# EasyEDA Pro project ProPrj_ESP32-S3-DevKitC-1-V1.2(立创EDA专业版导入可直接打样).epro

# Schematic ESP32-S3
Create Date: 2023-03-21; Page Name: P1; Project Name: ESP32-S3-DevKitC-1-V1.2; Schematic Name: ESP32-S3; Update Date: 2023-03-21; Company: https://rymcu.com; Page Size: A4; Version: V1.2
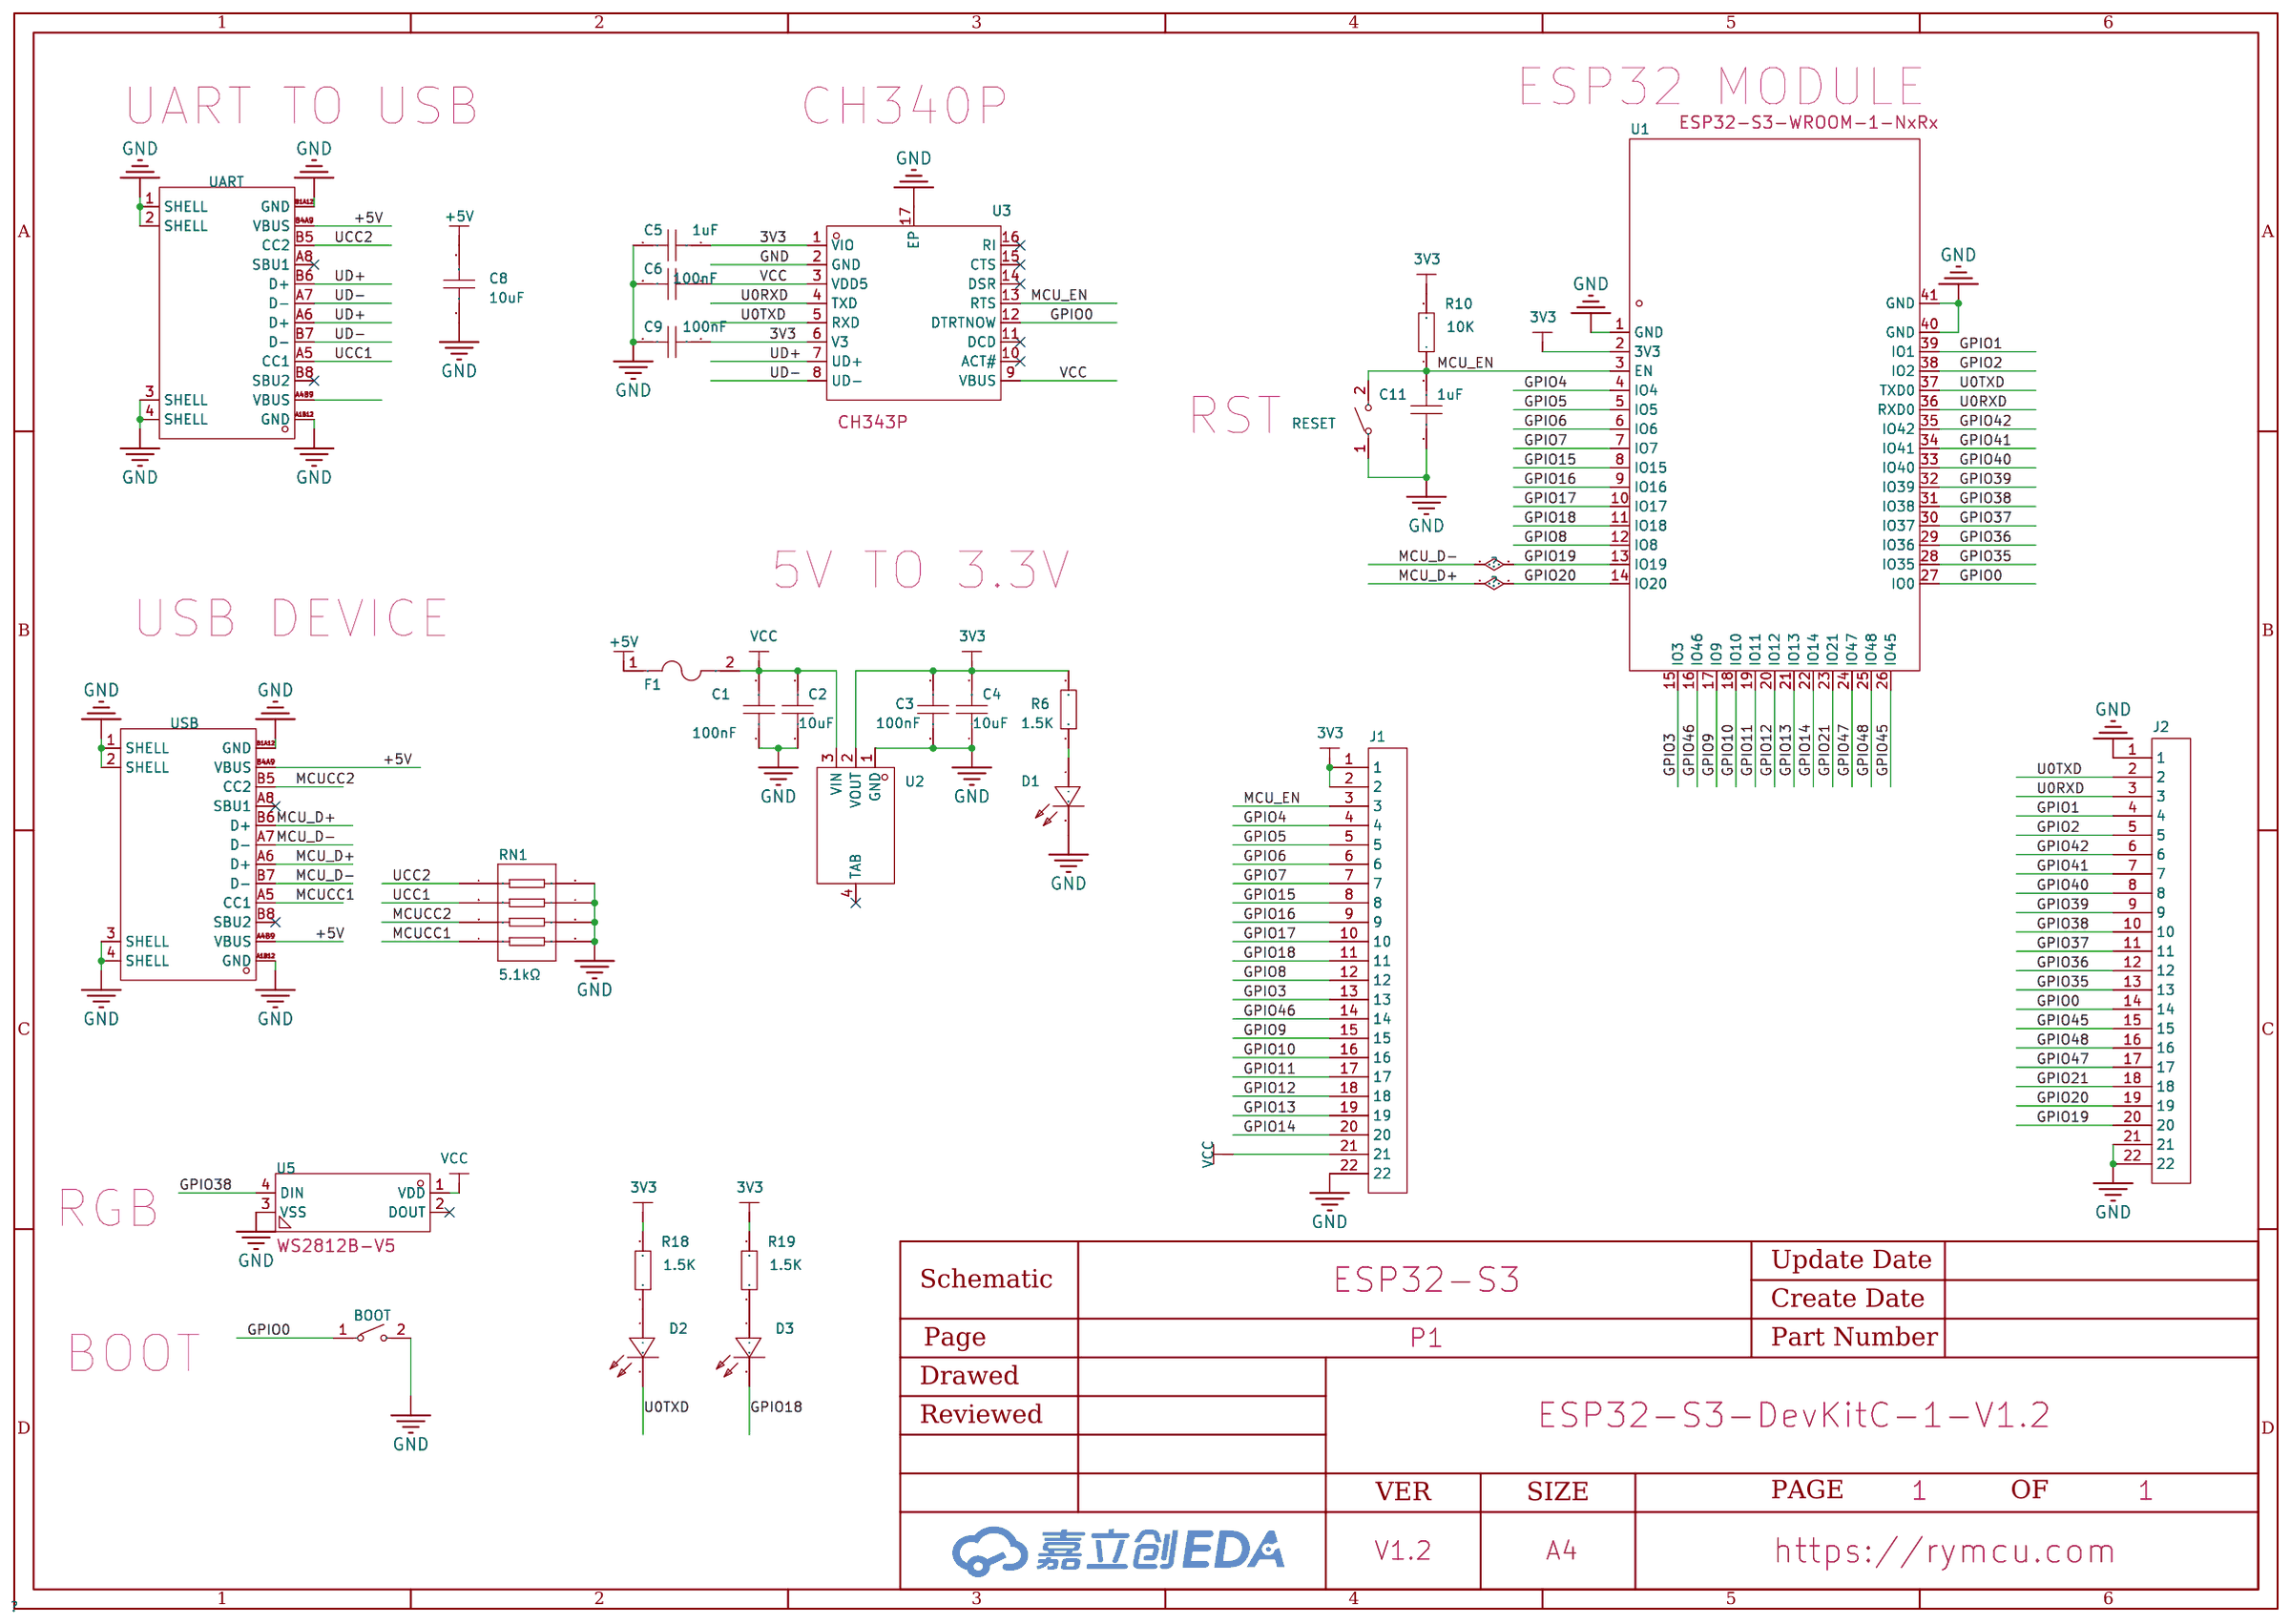
[diagram p0: schematic sheet]

## Parts
BOOT  TS-1088R-02526  [SW-SMD_L3.9-W3.0-P4.45]
C1  100nF  [C0603]
C2  10uF  [C0805]
C3  100nF  [C0603]
C4  10uF  [C0805]
C5  1uF  [C0603]
C6  100nF  [C0603]
C8  10uF  [C0805]
C9  100nF  [C0603]
C11  1uF  [C0603]
D1  NCD0603R3  [LED0603-R-RD_RED]
D2  NCD0603R3  [LED0603-R-RD_RED]
D3  NCD0603R3  [LED0603-R-RD_RED]
F1  -  [F0805]
J1  -  [22DIP]
J2  -  [22DIP]
R6  1.5K  [R0603]
R10  10K  [R0603]
R18  1.5K  [R0603]
R19  1.5K  [R0603]
RESET  TS-1088R-02526  [SW-SMD_L3.9-W3.0-P4.45]
RN1  5.1kΩ  [RES-ARRAY-SMD_0603-8P-L3.2-W1.6-BL]
U1  ESP32-S3-WROOM-1(N16R8)  [WIRELM-SMD_ESP32-S3-WROOM-1]
U2  -  [SOT-223-3_L6.5-W3.4-P2.30-LS7.0-BR]
U3  CH343P  [TQFN-16_L3.0-W3.0-P0.50-BL-EP1.7]
U5  WS2812B-V5  [LED-SMD_4P-L5.0-W5.0-TL_WS2812B-B]
UART  -  [USB-C-SMD_G-SWITCH_GT-USB-7010EN]
USB  -  [USB-C-SMD_G-SWITCH_GT-USB-7010EN]

## Library data of the parts
BOOT RESET = TS-1088R-02526: 触点电流:50mA;额定电压(DC):12V;电路结构:单刀单掷;安装方式:立贴;按钮形状:圆形按钮;带灯:-;开关长度:3.9mm;开关宽度:2.93mm;开关高度:2.5mm;; LCSC Part Name: 贴片无柱小龟轻触开关 260GF; Supplier Part: C455281; Manufacturer: XUNPU(讯普); Supplier Footprint: SMD,3x4x2.5mm; JLCPCB Part Class: Extended Part; Datasheet: https://atta.szlcsc.com/upload/public/pdf/source/20191118/C455281_EC5379764BC1462550DF64BBBFEA9579.pdf; Supplier: LCSC; Contact Current: 50mA; Voltage Rating (DC): 12V; Circuit: 单刀单掷; Mounting Style: 立贴; Actuator Style: 圆形按钮; Switch Length: 3.9mm; Switch Width: 2.93mm; Switch Height: 2.5mm
C1 C3 C5 C6 C9 C11 = CC0603KRX7R9BB104: 容值:100nF;精度:±10%;额定电压:50V;材质(温度系数):X7R;; LCSC Part Name: 100nF ±10% 50V; Supplier Part: C14663; Manufacturer: YAGEO(国巨); Supplier Footprint: 0603; JLCPCB Part Class: Basic Part; Datasheet: https://atta.szlcsc.com/upload/public/pdf/source/20170116/1484561234239.pdf; Supplier: LCSC; Tolerance: ±10%; Voltage Rated: 50V; Temperature Coefficient: X7R
C2 C4 C8 = CC0805FRNPO9BN330: 容值:33pF;精度:±1pF;额定电压:50V;材质(温度系数):NP0;; LCSC Part Name: 33pF ±1pF 50V; Supplier Part: C541516; Manufacturer: YAGEO(国巨); Supplier Footprint: 0805; JLCPCB Part Class: Extended Part; Datasheet: https://atta.szlcsc.com/upload/public/pdf/source/20200615/C541516_87B4F5CEA473EFDDBB2B4786DAFFF3AA.pdf; Supplier: LCSC; Tolerance: ±1pF; Voltage Rated: 50V; Temperature Coefficient: NP0
D1-D3 = NCD0603R3: 尺寸1.6x0.8x0.8；IF=20ma：1.6~2.6v，620~640nm,51~150mcd金线，光强高，功耗低，可靠性好，寿命长; LCSC Part Name: 红色;贴片LED;0603红灯;; Supplier Part: C3151730; Manufacturer: 国星光电; Supplier Footprint: 0603; JLCPCB Part Class: Extended Part; Datasheet: https://atta.szlcsc.com/upload/public/pdf/source/20220704/CBFF28C1847A97213A75929E60B7DDE7.pdf; Supplier: LCSC
F1 = ASMD0805-075: 最大电压:6V;最大电流:40A;保持电流:750mA;跳闸电流:1.5A;消耗功率:600mW;初始态阻值(最小值):90mΩ;跳断后阻值(最大值):385mΩ;最大动作时间:200ms;工作温度:-40~+85;; LCSC Part Name: 0.75A 自恢复; Supplier Part: C135330; Manufacturer: JDTfuse集电通; Supplier Footprint: 0805; JLCPCB Part Class: Extended Part; Datasheet: https://atta.szlcsc.com/upload/public/pdf/source/20171014/C135330_15079756464341038401.pdf; Supplier: LCSC; Operating Voltage (Max): 6V; Current Rating (Max): 40A; Hold Current: 750mA; Trip Current: 1.5A; Power Dissipation: 600mW; Resistance - Initial (Ri) (Min): 90mΩ; Resistance - Post Trip (R1) (Max): 385mΩ; Maximum Time to Trip: 200ms; Operating Temperature: -40~+85
J1 J2 = DIP22
R6 R10 R18 R19 = TR0603B10K0P0525Z: 电阻类型:薄膜电阻;阻值:10kΩ;精度:±0.1%;功率:100mW;温度系数:±25ppm/;最大工作电压:75V;工作温度范围:-55~+155;; LCSC Part Name: 10kΩ ±0.1% 100mW; Supplier Part: C188363; Manufacturer: EVER OHMS(天二科技); Supplier Footprint: 0603; JLCPCB Part Class: Extended Part; Datasheet: https://atta.szlcsc.com/upload/public/pdf/source/20190415/C188363_433BF05B6FB8F7A0F5F35A3E4390C55A.pdf; Supplier: LCSC; Type: 薄膜电阻; Tolerance: ±0.1%; Power(Watts): 100mW; Temperature Coefficient: ±25ppm/; Overload Voltage (Max): 75V; Operating Temperature Range: -55~+155
RN1 = 4D03WGJ0512T5E: 阻值:5.1kΩ;精度:±5%;单个元件功率:62.5mW;温度系数:±200ppm/;电阻器数:4;引脚数:8;; LCSC Part Name: 5.1kΩ ±5% 0603x4; Supplier Part: C12028; Manufacturer: UNI-ROYAL(厚声); Supplier Footprint: 0603x4; JLCPCB Part Class: Extended Part; Datasheet: https://atta.szlcsc.com/upload/public/pdf/source/20170615/1497510926628.pdf; Supplier: LCSC; Tolerance: ±5%; Power(Watts): 62.5mW; Temperature Coefficient: ±200ppm/; Number of Resistors: 4; Number of Pins: 8
U1 = ESP32-S3-WROOM-1(N16R8): LCSC Part Name: ESP32-S3-WROOM-1-NxRx; Supplier Part: C2913202; Manufacturer: ESPRESSIF(乐鑫); Supplier Footprint: ESP32-S3R8; JLCPCB Part Class: 扩展库; Datasheet: https://atta.szlcsc.com/upload/public/pdf/source/20220705/4E799F39581577F766659887F738A439.pdf; Supplier: LCSC
U2 = AMS1117-3.3: 输出类型:固定;输出极性:正;输出通道数:1;最大输入电压:18V;输出电压:3.3V;压差:1.4V@(1A);输出电流:800mA;电源纹波抑制比(PRSS):-;; LCSC Part Name: Vin=18V Vout=3.3V 800mA; Supplier Part: C351784; Manufacturer: PUOLOP(迪浦); Supplier Footprint: SOT-223; JLCPCB Part Class: Extended Part; Datasheet: https://atta.szlcsc.com/upload/public/pdf/source/20210915/EA806799CEEC3F52E0A4FA8303A508AC.pdf; Supplier: LCSC; Output Type: 固定; Output Polarity: 正; Number of Outputs: 1; Maximum Input Voltage: 18V; Output Voltage: 3.3V; Dropout Voltage: 1.4V@(1A); Output Current: 800mA
U3 = CH343P: 类型:-;协议类别:-;驱动器/接收器数:-;数据速率:-;; Supplier Part: C2846043; Manufacturer: WCH(南京沁恒); Supplier Footprint: QFN-16; JLCPCB Part Class: 扩展库; Datasheet: https://atta.szlcsc.com/upload/public/pdf/source/20211010/C2846043_7FA705E1F14A2906F6A2AFA45FA28209.pdf; Supplier: LCSC
U5 = WS2812B-V5: Supplier Part: C691873; Supplier Footprint: SMD,5x5mm; Supplier: LCSC
UART USB = HC-TYPE-C-16P-01A-R: 连接器类型:Type-C;公母:母座;触点数量:16;端口数量:1;安装方式:卧贴;; LCSC Part Name: Type-C 母座 卧贴; Supplier Part: C2997433; Manufacturer: HCTL(华灿天禄); Supplier Footprint: SMD; Datasheet: https://atta.szlcsc.com/upload/public/pdf/source/20220415/23B51DCADC5F28223C40C3605487ACA1.pdf; Supplier: LCSC; Connector Type: Type-C; Gender: 母座; Number of Contacts: 16; Number of Ports: 1; Mounting Style: 卧贴

## Nets
3V3: C3.1 C4.2 C5.1 C9.1 J1.1 J1.2 R6.1 R10.2 R18.2 R19.2 U1.2(3V3) U2.2(VOUT) U3.1(VIO) U3.6(V3)
+5V: C8.2 F1.1 UART.A4B9(VBUS) UART.B4A9(VBUS) USB.A4B9(VBUS) USB.B4A9(VBUS)
GND: BOOT.2 C1.1 C2.1 C3.2 C4.1 C5.2 C6.2 C8.1 C9.2 C11.1 D1.2(K) J1.22 J2.1 J2.21 J2.22 RESET.1 RN1.5 RN1.6 RN1.7 RN1.8 U1.1(GND) U1.40(GND) U1.41(GND) U2.1(GND) U3.2(GND) U3.17(EP) U5.3(VSS) UART.1(SHELL) UART.2(SHELL) UART.3(SHELL) UART.4(SHELL) UART.A1B12(GND) UART.B1A12(GND) USB.1(SHELL) USB.2(SHELL) USB.3(SHELL) USB.4(SHELL) USB.A1B12(GND) USB.B1A12(GND)
VCC: C1.2 C2.2 C6.1 F1.2 J1.21 U2.3(VIN) U3.3(VDD5) U3.9(VBUS) U5.1(VDD)
GPIO0: BOOT.1 J2.14 U1.27(IO0) U3.12(DTRTNOW)
GPIO1: J2.4 U1.39(IO1)
GPIO2: J2.5 U1.38(IO2)
GPIO3: J1.13 U1.15(IO3)
GPIO4: J1.4 U1.4(IO4)
GPIO5: J1.5 U1.5(IO5)
GPIO6: J1.6 U1.6(IO6)
GPIO7: J1.7 U1.7(IO7)
GPIO8: J1.12 U1.12(IO8)
GPIO9: J1.15 U1.17(IO9)
GPIO10: J1.16 U1.18(IO10)
GPIO11: J1.17 U1.19(IO11)
GPIO12: J1.18 U1.20(IO12)
GPIO13: J1.19 U1.21(IO13)
GPIO14: J1.20 U1.22(IO14)
GPIO15: J1.8 U1.8(IO15)
GPIO16: J1.9 U1.9(IO16)
GPIO17: J1.10 U1.10(IO17)
GPIO18: D3.2(K) J1.11 U1.11(IO18)
GPIO19: J2.20 U1.13(IO19) USB.A7(D-) USB.B7(D-)
GPIO20: J2.19 U1.14(IO20) USB.A6(D+) USB.B6(D+)
GPIO21: J2.18 U1.23(IO21)
GPIO35: J2.13 U1.28(IO35)
GPIO36: J2.12 U1.29(IO36)
GPIO37: J2.11 U1.30(IO37)
GPIO38: J2.10 U1.31(IO38) U5.4(DIN)
GPIO39: J2.9 U1.32(IO39)
GPIO40: J2.8 U1.33(IO40)
GPIO41: J2.7 U1.34(IO41)
GPIO42: J2.6 U1.35(IO42)
GPIO45: J2.15 U1.26(IO45)
GPIO46: J1.14 U1.16(IO46)
GPIO47: J2.17 U1.24(IO47)
GPIO48: J2.16 U1.25(IO48)
MCU_EN: C11.2 J1.3 R10.1 RESET.2 U1.3(EN) U3.13(RTS)
MCUCC1: RN1.4 USB.A5(CC1)
MCUCC2: RN1.3 USB.B5(CC2)
U0RXD: J2.3 U1.36(RXD0) U3.4(TXD)
U0TXD: D2.2(K) J2.2 U1.37(TXD0) U3.5(RXD)
UCC1: RN1.2 UART.A5(CC1)
UCC2: RN1.1 UART.B5(CC2)
UD+: U3.7(UD+) UART.A6(D+) UART.B6(D+)
UD-: U3.8(UD-) UART.A7(D-) UART.B7(D-)
$3N22002: D1.1(A) R6.2
$3N24719: D2.1(A) R18.1
$3N24720: D3.1(A) R19.1

Not connected (* = marked no-connect by the designer): U2 4(TAB)*; U3 10(ACT#)* 11(DCD)* 14(DSR)* 15(CTS)* 16(RI)*; U5 2(DOUT)*; UART A8(SBU1)* B8(SBU2)*; USB A8(SBU1)* B8(SBU2)*

## Notes on the sheet
- ESP32 MODULE
- UART TO USB
- CH340P
- RST
- 5V TO 3.3V
- USB DEVICE
- RGB
- BOOT

# Board PCB1
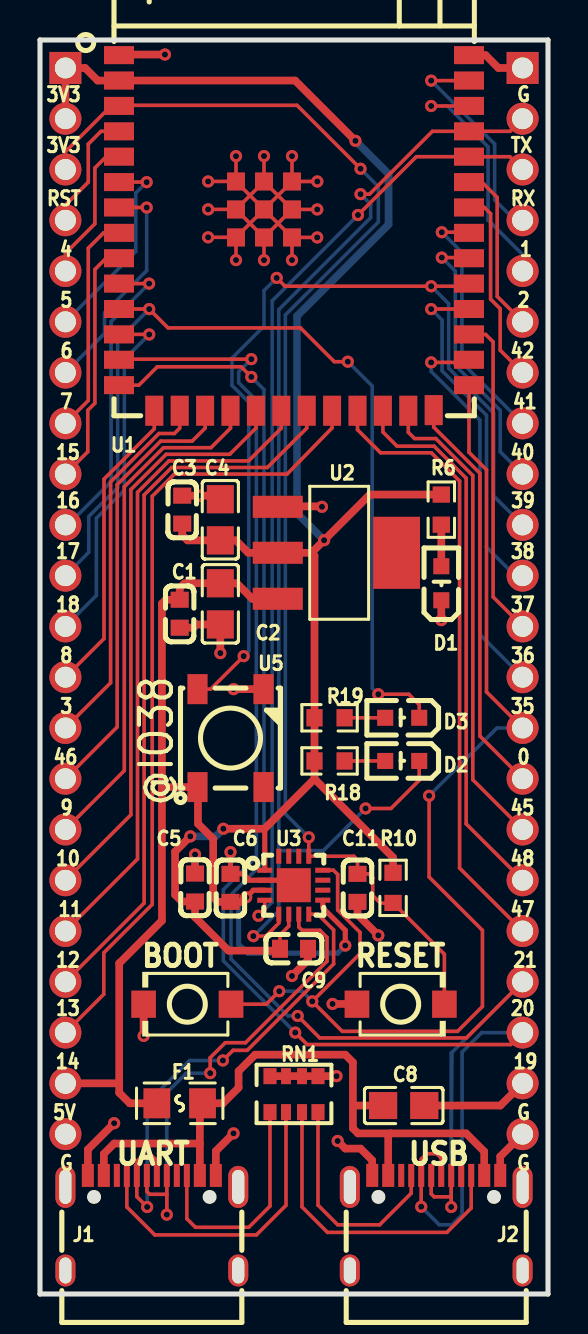
[diagram p1: board, top side]
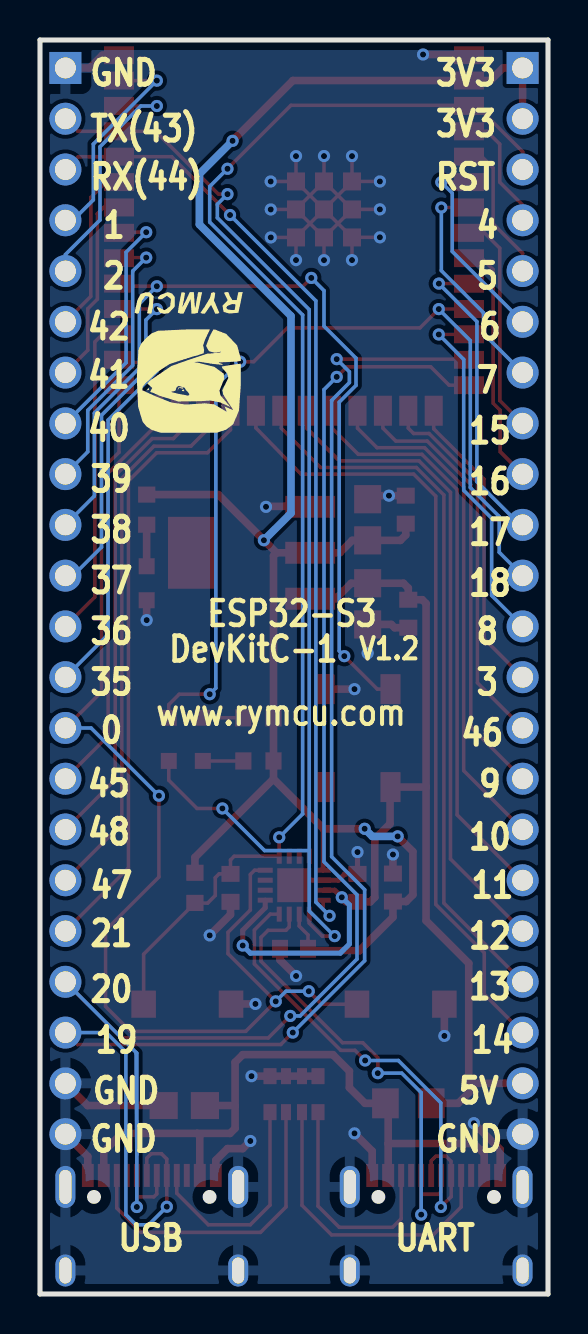
[diagram p2: board, bottom side, seen from below]

Outline 25.4 x 62.74 mm; copper layers: Top Layer, Bottom Layer. Coordinates in mm from the lower left corner of the outline.
Outline path: 0,62.74 25.4,62.74 25.4,0 0,0 0,62.74
Stack: Top Layer 0.035mm / Dielectric1 1.51mm FR4 er 4.5 / Bottom Layer 0.035mm

## Design rules (mm)
spacing safeClearance (default): track to track 0.152, other pairs 0.152 to 0.3
track width trackWidth (default): min 0.127, default 0.178, max 2.54
differential pair differentialPair (default): width min 0.127, default 0.254, max 2.54; gap min 0.152, default 0.152
via viaSize (default): diameter min 0.5, default 0.61, max 10; hole min 0.3, default 0.305, max 6

## Placement (name value [footprint] x y rotation side)
BOOT  TS-1088R-02526  [SW-SMD_L3.9-W3.0-P4.45]  7.37 14.5 180 top
C1  100nF  [C0603]  6.99 34.04 90 top
C2  10uF  [C0805]  9.02 34.53 90 top
C3  100nF  [C0603]  7.11 39.24 90 top
C4  10uF  [C0805]  9.02 38.73 270 top
C5  1uF  [C0603]  7.75 20.34 90 top
C6  100nF  [C0603]  9.53 20.32 90 top
C8  10uF  [C0805]  18.19 9.43 180 top
C9  100nF  [C0603]  12.7 17.27 0 top
C11  1uF  [C0603]  15.88 20.32 90 top
D1  NCD0603R3  [LED0603-R-RD_RED]  20.07 35.56 90 top
D2  NCD0603R3  [LED0603-R-RD_RED]  18.11 26.67 180 top
D3  NCD0603R3  [LED0603-R-RD_RED]  18.11 28.83 180 top
F1  -  [F0805]  6.99 9.54 180 top
J1  -  [22DIP]  1.27 34.67 270 top
J2  -  [22DIP]  24.13 34.67 270 top
R6  1.5K  [R0603]  20.07 39.24 270 top
R10  10K  [R0603]  17.65 20.32 90 top
R18  1.5K  [R0603]  14.48 26.67 180 top
R19  1.5K  [R0603]  14.48 28.83 180 top
RESET  TS-1088R-02526  [SW-SMD_L3.9-W3.0-P4.45]  18.03 14.5 0 top
RN1  5.1kΩ  [RES-ARRAY-SMD_0603-8P-L3.2-W1.6-BL]  12.7 10 0 top
U1  ESP32-S3-WROOM-1(N16R8)  [WIRELM-SMD_ESP32-S3-WROOM-1]  12.7 53.09 0 top
U2  -  [SOT-223-3_L6.5-W3.4-P2.30-LS7.0-BR]  14.86 37.08 180 top
U3  CH343P  [TQFN-16_L3.0-W3.0-P0.50-BL-EP1.7]  12.69 20.45 270 top
U5  WS2812B-V5  [LED-SMD_4P-L5.0-W5.0-TL_WS2812B-B]  9.53 27.81 90 top
UART  -  [USB-C-SMD_G-SWITCH_GT-USB-7010EN]  5.59 3.56 0 top
USB  -  [USB-C-SMD_G-SWITCH_GT-USB-7010EN]  19.81 3.56 0 top

## Footprints (pads in the part's own frame, mm; a bottom-side part is the same pattern mirrored in y, then rotated)
22DIP
  rect 1.6x1.6 hole 1.049: 1(-26.67,0)
  round 1.6 hole 1.049: 2(-24.13,0) 3(-21.59,0) 4(-19.05,0) 5(-16.51,0) 6(-13.97,0) 7(-11.43,0) 8(-8.89,0) 9(-6.35,0) 10(-3.81,0) 11(-1.27,0) 12(1.27,0) 13(3.81,0) 14(6.35,0) 15(8.89,0) 16(11.43,0) 17(13.97,0) 18(16.51,0) 19(19.05,0) 20(21.59,0) 21(24.13,0) 22(26.67,0)
C0603
  rect 0.8x0.9 smd: 1(-0.7,0) 2(0.7,0)
C0805
  rect 1.41x1.35 smd: 1(-1.03,0) 2(1.03,0)
F0805
  rect 1.335x1.5 smd: 1(-1.143,0) 2(1.143,0)
LED0603-R-RD_RED
  rect 0.8x0.8 smd: 1(0.851,0) 2(-0.851,0)
LED-SMD_4P-L5.0-W5.0-TL_WS2812B-B
  rect 1.5x1 smd: 1(-2.45,1.65) 2(-2.45,-1.65) 3(2.45,-1.65) 4(2.45,1.65)
R0603
  rect 0.806x0.864 smd: 1(-0.753,0) 2(0.753,0)
RES-ARRAY-SMD_0603-8P-L3.2-W1.6-BL
  rect 0.65x0.8 smd: 1(-1.2,-0.9) 4(1.2,-0.9) 5(1.2,0.9) 8(-1.2,0.9)
  rect 0.5x0.8 smd: 2(-0.4,-0.9) 3(0.4,-0.9) 6(0.4,0.9) 7(-0.4,0.9)
SOT-223-3_L6.5-W3.4-P2.30-LS7.0-BR
  rect 2.5x1.1 smd: 1(2.97,-2.3) 2(2.97,0) 3(2.97,2.3)
  rect 2.34x3.6 smd: 4(-2.97,0)
SW-SMD_L3.9-W3.0-P4.45
  rect 1.23x1.36 smd: 1(-2.185,0) 2(2.185,0)
TQFN-16_L3.0-W3.0-P0.50-BL-EP1.7
  rect 0.25x0.75 smd: 1(-0.749,-1.45) 2(-0.248,-1.45) 3(0.252,-1.45) 4(0.751,-1.45) 9(0.75,1.45) 10(0.25,1.45) 11(-0.25,1.45) 12(-0.749,1.45)
  rect 0.75x0.25 smd: 5(1.45,-0.75) 6(1.45,-0.25) 7(1.45,0.25) 8(1.45,0.75) 13(-1.45,0.75) 14(-1.45,0.25) 15(-1.45,-0.25) 16(-1.45,-0.75)
  rect 1.7x1.7 smd: 17(0.001,0)
USB-C-SMD_G-SWITCH_GT-USB-7010EN
  oval 1x2.1 hole 0.6x1.7: 1(-4.32,1.802) 2(4.32,1.802)
  oval 1x1.6 hole 0.6x1.3: 3(4.32,-2.377) 4(-4.32,-2.377)
  rect 0.6x1.15 smd: A1B12(-3.2,2.377) A4B9(-2.4,2.377) B1A12(3.2,2.377) B4A9(2.4,2.377)
  rect 0.3x1.15 smd: A5(-1.25,2.377) A6(-0.25,2.377) A7(0.25,2.377) A8(1.25,2.377) B5(1.75,2.377) B6(0.75,2.377) B7(-0.75,2.377) B8(-1.75,2.377)
WIRELM-SMD_ESP32-S3-WROOM-1
  rect 1.5x0.9 smd: 1(-8.75,8.895) 2(-8.75,7.625) 3(-8.75,6.355) 4(-8.75,5.085) 5(-8.75,3.815) 6(-8.75,2.545) 7(-8.75,1.275) 8(-8.75,0.005) 9(-8.75,-1.265) 10(-8.75,-2.535) 11(-8.75,-3.805) 12(-8.75,-5.075) 13(-8.75,-6.345) 14(-8.75,-7.615) 27(8.75,-7.615) 28(8.75,-6.345) 29(8.75,-5.075) 30(8.75,-3.805) 31(8.75,-2.535) 32(8.75,-1.265) 33(8.75,0.005) 34(8.75,1.275) 35(8.75,2.545) 36(8.75,3.815) 37(8.75,5.085) 38(8.75,6.355) 39(8.75,7.625) 40(8.75,8.895)
  rect 0.9x1.5 smd: 15(-6.985,-8.895) 16(-5.715,-8.895) 17(-4.445,-8.895) 18(-3.175,-8.895) 19(-1.905,-8.895) 20(-0.635,-8.895) 21(0.635,-8.895) 22(1.905,-8.895) 23(3.175,-8.895) 24(4.445,-8.895) 25(5.715,-8.895) 26(6.985,-8.865)
  rect 0.9x0.9 smd: 41(-2.9,2.575) 41(-2.9,1.175) 41(-2.9,-0.225) 41(-1.5,2.575) 41(-1.5,1.175) 41(-1.5,-0.225) 41(-0.1,2.575) 41(-0.1,1.175) 41(-0.1,-0.225)

## Nets
As in the schematic.

Pads without a net: U2 4; U3 10 11 14 15 16; U5 2; UART A8 B8; USB A8 B8

## Via types
v1: diameter 0.61, hole 0.305, Top Layer to Bottom Layer, 71 vias

## Routing (per net, layer and track width the routed paths; a pad name or vN(x,y) marks a point on that pad's centre or on a via; arc(x,y) is an arc through that point)
3V3: length 96
  Top Layer w0.178: C9.1 12,17.97 12.44,18.41 U3.6
  Top Layer w0.254: U3.1 11.24,23.29
  Top Layer w0.381: 11.23,23.28 v1(9.17,23.28) ; 13.58,37.08 v1(14.21,37.71) 16.49,40 R6.1 ; 13.58,37.08 U2.2 10.41,37.08 9.79,37.7 C4.2 7.38,37.7 7.11,37.97 7.11,38.54 ; 13.58,37.08 13.72,36.94 R19.2 R18.2 13.72,25.77 ; J1.2 J1.1 2.25,61.34 2.88,60.71 U1.2 12.75,60.71 v1(15.77,57.69) ; 11.24,23.29 13.72,25.77 ; 13.72,25.77 17.65,21.84 R10.2 ; C9.1 11.91,17.18 9.42,17.18 7.75,18.85 C5.1 7.09,19.64 6.75,19.97 6.75,22.13 v1(7.52,22.9)
  Bottom Layer w0.381: v1(15.77,57.69) 17.43,56.04 17.43,53.51 12.85,48.93 12.85,39.07 v1(14.21,37.71) ; v1(9.17,23.28) 8.79,22.9 v1(7.52,22.9)
+5V: length 34.2
  Top Layer w0.381: 15.65,9.41 15.65,11.59 15.26,11.97 10.75,11.97 9.93,11.15 9.93,10.32 9.15,9.54 F1.1 7.99,9.47 7.99,7.53 ; 15.65,9.41 15.66,9.43 C8.2 ; 15.65,9.41 15.65,8.29 15.9,8.04 17.54,8.04 ; 17.54,8.04 21.3,8.04 22.21,7.13 USB.B4A9 ; 17.54,8.04 17.41,7.91 USB.A4B9 ; UART.B4A9 7.99,7.53 ; 7.99,7.53 3.71,7.53 3.19,7.01 UART.A4B9
GND: length 78.3
  Top Layer w0.178: U1.41 v1(13.86,52.86) ; U1.41 11.9,53.56 ; U1.41 v1(12.6,51.73) ; U1.41 v1(11.2,56.93) ; U1.41 11.9,54.96 ; U1.41 10.5,54.96 ; 11.9,54.96 U1.41 ; 11.9,54.96 U1.41 ; 11.9,54.96 U1.41 ; U1.41 11.9,53.56 ; U1.41 10.5,54.96 ; U1.41 10.5,53.56 ; 9.8,55.66 v1(8.41,55.66) ; U1.41 v1(13.86,54.26) ; U1.41 11.9,53.56 ; U1.41 v1(11.2,51.72) ; U1.41 11.9,53.56 ; U1.41 10.5,53.56 ; U1.41 v1(12.6,56.93) ; U1.41 v1(13.87,55.66) ; 10.5,54.96 U1.41 v1(9.8,56.93) ; 10.5,54.96 U1.41 ; U1.41 10.5,53.56 ; U1.41 9.8,54.26 v1(8.41,54.26) ; 10.5,53.56 U1.41 ; U1.41 v1(9.8,51.73) ; U1.41 9.79,52.87 v1(8.41,52.87)
  Top Layer w0.254: v1(9.53,22.11) C6.2 10.16,21.02 10.47,20.7 U3.2 12.44,20.7 U3.17
  Top Layer w0.381: J2.21 23.02,9.43 C8.1 ; U1.40 22.28,61.98 22.92,61.34 J2.1 ; UART.B1A12 8.79,7.15 v1(9.68,8.04) ; v1(3.71,8.54) 2.39,7.23 UART.A1B12 ; v1(14.1,39.38) 14.08,39.41 11.91,39.41 U2.1 ; USB.B1A12 23.01,6.88 J2.22 ; C1.1 7.67,33.34 7.83,33.5 C2.1 v1(9.02,32.06) ; USB.A1B12 16.61,6.69 16.03,7.27 15.26,7.27 v1(14.88,7.66) ; v1(14.63,14.51) 15.84,14.51 RESET.1 ; U5.3 v1(9.68,30.26) ; C5.2 v1(7.75,21.99) ; C4.1 8.84,39.94 v1(7.95,39.94) C3.2 ; U1.1 3.98,62.01 v1(6.25,62.01) ; C9.2 13.4,16.71 v1(12.6,15.91) ; v1(14.82,10.9) RN1.5 RN1.6 RN1.7 RN1.8 ; BOOT.2 v1(5.18,12.91) ; C11.1 15.88,18.98 v1(16.91,17.94) ; D1.2 v1(20.07,33.71)
VCC: length 58.5
  Top Layer w0.254: v1(15.26,17.43) 15.26,18.2 14.14,19.32 U3.9 ; U3.3 10.66,20.2 v1(10.31,19.85)
  Top Layer w0.381: 3.96,10.58 3.96,10.07 4.49,9.54 F1.2 ; 3.96,10.58 3.96,16.55 6.1,18.68 6.1,25.36 ; 3.96,10.58 3.92,10.54 J1.21 ; U2.3 10.62,34.78 9.84,35.56 C2.2 7.23,35.56 6.99,35.32 C1.2 6.29,34.74 6.1,34.54 6.1,25.36 ; v1(10.31,19.85) 10.08,19.62 C6.1 8.89,19.62 8.66,19.85 8.66,22.77 7.9,23.53 7.9,25.34 U5.1 6.1,25.36
  Bottom Layer w0.254: v1(15.26,17.43) 14.88,17.05 10.39,17.05 9.93,17.51 9.93,19.47 v1(10.31,19.85)
GPIO0: length 58.8
  Top Layer w0.178: J2.14 22.32,30.12 22.32,41.23 21.45,42.11 U1.27 ; U3.12 14.67,21.2 14.88,20.99 14.88,19.21 16,18.1 16,17.03 v1(13.61,14.64) 15.11,13.14 20.88,13.14 22.12,14.39 22.12,18.2 19.46,20.86 v1(19.46,24.93) ; BOOT.1 11.31,14.5 v1(11.96,15.15)
  Bottom Layer w0.178: J2.14 22.85,28.32 v1(19.46,24.93) ; v1(11.96,15.15) 13.1,15.15 v1(13.61,14.64)
GPIO1: length 11
  Top Layer w0.178: v1(19.56,60.71) 21.44,60.71 U1.39
  Bottom Layer w0.178: J2.4 23.75,53.72 22.73,54.74 22.73,57.53 v1(19.56,60.71)
GPIO2: length 12.5
  Top Layer w0.178: v1(19.56,59.44) 21.44,59.44 U1.38
  Bottom Layer w0.178: J2.5 24.13,52 22.4,53.73 22.4,57.39 20.36,59.44 v1(19.56,59.44)
GPIO3: length 15.2
  Top Layer w0.178: U1.15 5.72,43.29 3.2,40.77 3.2,32.79 J1.13
GPIO4: length 6.1
  Top Layer w0.178: 3.95,58.17 3.05,58.17 2.41,57.53 2.41,55.63 1.27,54.48 J1.4
GPIO5: length 7.2
  Top Layer w0.178: J1.5 1.27,52.07 2.74,53.54 2.74,56.34 3.3,56.9 3.94,56.9 U1.5
GPIO6: length 10.1
  Top Layer w0.178: U1.6 5.33,55.63 v1(5.33,55.63)
  Bottom Layer w0.178: J1.6 4.79,52.16 4.79,55.08 v1(5.33,55.63)
GPIO7: length 11.3
  Top Layer w0.178: U1.7 5.33,54.36 v1(5.33,54.36)
  Bottom Layer w0.178: J1.7 3.22,48.05 3.22,49.09 5.33,51.2 v1(5.33,54.36)
GPIO8: length 17.9
  Top Layer w0.178: v1(5.46,48.01) 5.46,48.01 U1.12
  Bottom Layer w0.178: v1(5.46,48.01) 4.22,46.76 4.22,40.21 2.82,38.81 2.82,34.95 J1.12
GPIO9: length 22.2
  Top Layer w0.178: J1.15 3.86,28.37 3.86,40.5 6.03,42.67 7.61,42.67 8.25,43.32 U1.17
GPIO10: length 25.8
  Top Layer w0.178: U1.18 9.53,43.32 8.55,42.34 6.17,42.34 4.22,40.38 4.22,26.18 J1.16
GPIO11: length 29.3
  Top Layer w0.178: J1.17 4.54,23.97 4.54,40.25 6.31,42.01 9.49,42.01 10.79,43.32 U1.19
GPIO12: length 32.8
  Top Layer w0.178: J1.18 4.88,21.77 4.88,40.11 6.45,41.68 10.43,41.68 12.06,43.32 U1.20
GPIO13: length 36.4
  Top Layer w0.178: J1.19 5.21,19.56 5.21,39.97 6.58,41.35 11.37,41.35 13.34,43.32 U1.21
GPIO14: length 39.9
  Top Layer w0.178: U1.22 14.6,43.33 12.35,41.02 6.72,41.02 5.61,39.91 5.61,19.49 3.19,17.07 3.19,15 J1.20
GPIO15: length 11.1
  Top Layer w0.178: 3.95,53.09 3.18,53.09 2.41,52.32 2.41,44.7 J1.8
GPIO16: length 12.3
  Top Layer w0.178: U1.9 3.31,51.82 2.74,51.26 2.74,44.57 2.39,44.21 2.39,42.14 J1.9
GPIO17: length 15.4
  Top Layer w0.178: U1.10 v1(5.46,50.55)
  Bottom Layer w0.178: v1(5.46,50.55) 3.55,48.65 3.55,40.64 1.4,38.48 J1.10
GPIO18: length 47.8
  Top Layer w0.178: v1(16.91,30.01) 18.44,30.01 18.96,29.49 D3.2 ; v1(15.39,46.64) 14.72,46.64 13.02,48.34 6.4,48.34 5.46,49.28 U1.11
  Bottom Layer w0.178: v1(5.46,49.28) 3.88,47.7 3.88,40.35 2.44,38.9 2.44,37.11 J1.11 ; v1(15.39,46.64) 16.61,45.43 16.61,30.31 v1(16.91,30.01)
GPIO19: length 73.6
  Top Layer w0.178: v1(10.56,46.77) 3.98,46.77 ; v1(12.76,13.08) 13.36,12.48 23.53,12.48 J2.20 ; v1(19.06,4.37) USB.B7 19.06,6.75 19.33,7.02 19.84,7.02 20.06,6.8 USB.A7
  Bottom Layer w0.178: v1(10.56,46.77) 9.93,46.14 9.93,45.6 10.82,44.71 10.82,21.88 9.17,20.23 9.17,16.67 v1(12.76,13.08) ; J2.20 22.09,13.08 21.11,12.1 21.11,3.97 20.6,3.46 19.96,3.46 v1(19.06,4.37)
GPIO20: length 76.1
  Top Layer w0.178: v1(24.13,15.62) 21.32,12.81 13.99,12.81 v1(12.88,13.91) ; U1.14 4.95,45.47 5.87,46.39 10.06,46.39 v1(10.56,45.88) ; USB.A6 19.56,5.01 19.71,4.86 20.56,4.86 ; USB.B6 20.56,4.86 ; 20.56,4.86 20.56,4.35
  Bottom Layer w0.178: 20.6,12.09 20.56,12.05 20.56,6.98 ; 20.6,12.09 20.56,6.98 ; 20.6,12.09 v1(24.13,15.62) ; 20.56,6.98 v1(20.56,4.35) ; v1(12.88,13.91) 12.4,13.91 9.55,16.76 9.55,19.97 11.2,21.63 11.2,45.25 v1(10.56,45.88)
GPIO21: length 30.9
  Top Layer w0.178: J2.18 20.98,21.31 20.98,40.68 19.57,42.09 17.03,42.09 15.88,43.24 U1.23
GPIO35: length 19.6
  Top Layer w0.178: v1(19.56,46.61) 21.32,46.61 U1.28
  Bottom Layer w0.178: v1(19.56,46.61) 19.56,46.16 22,43.72 22,32.99 J2.13
GPIO36: length 16.2
  Top Layer w0.178: U1.29 21.46,48.01 22.28,48.01 22.66,47.64 22.66,34.87 J2.12
GPIO37: length 17.3
  Top Layer w0.178: v1(19.56,49.28) 19.56,49.28 U1.30
  Bottom Layer w0.178: v1(19.56,49.28) 20.1,48.73 20.1,46.18 22.32,43.96 22.32,37.36 23.75,35.94 J2.11
GPIO38: length 47
  Top Layer w0.178: U1.31 21.32,50.42 v1(19.56,50.42) 12.25,50.42 v1(11.84,50.84) ; U5.4 8.53,30.26 v1(10.18,31.91)
  Bottom Layer w0.178: v1(11.84,50.84) 11.2,50.2 11.2,48.42 9.6,46.82 9.6,45.46 10.44,44.62 10.44,32.17 v1(10.18,31.91) ; v1(19.56,50.42) 20.43,49.54 20.43,46.32 22.68,44.07 22.68,39.93 J2.10
GPIO39: length 13.9
  Top Layer w0.178: 20.05,51.82 v1(20.09,51.85) 21.42,51.85 U1.32
  Bottom Layer w0.178: J2.9 23.01,42.14 23.01,44.21 20.76,46.46 20.76,51.18 v1(20.09,51.85)
GPIO40: length 12.6
  Top Layer w0.178: v1(20.09,53.12) 21.42,53.12 21.45,53.09
  Bottom Layer w0.178: J2.8 21.09,46.59 21.09,52.12 v1(20.09,53.12)
GPIO41: length 9.8
  Top Layer w0.178: U1.34 22.22,54.36 22.53,54.05 22.53,49.77 23.01,49.29 23.01,47.22 J2.7
GPIO42: length 8.5
  Top Layer w0.178: U1.35 22.09,55.63 22.86,54.86 22.86,49.91 J2.6
GPIO45: length 20.3
  Top Layer w0.178: U1.26 19.69,43.37 22,41.06 22,27.91 J2.15
GPIO46: length 18.7
  Top Layer w0.178: U1.16 6.99,43.32 6.72,43.05 5.95,43.05 3.53,40.63 3.53,30.58 J1.14
GPIO47: length 27.5
  Top Layer w0.178: U1.24 17.15,43.12 17.85,42.42 19.7,42.42 21.31,40.81 21.31,23.52 J2.17
GPIO48: length 23.9
  Top Layer w0.178: U1.25 18.41,43.11 18.73,42.8 19.79,42.8 21.64,40.95 21.64,25.73 J2.16
MCU_EN: length 67.3
  Top Layer w0.178: J1.3 1.27,57.15 3.56,59.44 U1.3 3.98,59.47 12.85,59.47 v1(16.03,56.3) ; v1(13.44,22.85) U3.13 15.69,21.9 15.88,21.72 C11.2 16.44,21.02 16.64,20.83 16.64,19.94 17.02,19.56 17.64,19.56 R10.1 20.22,17 RESET.2
  Bottom Layer w0.178: v1(13.44,22.85) 12.27,24.02 12.27,48.98 16.91,53.63 16.91,55.41 v1(16.03,56.3)
MCUCC1: length 11.3
  Top Layer w0.178: RN1.4 13.9,4.45 14.88,3.46 16.98,3.46 18.56,5.04 USB.A5
MCUCC2: length 15.9
  Top Layer w0.178: RN1.3 13.1,4.36 14.38,3.08 20.34,3.08 21.56,4.3 USB.B5
U0RXD: length 47.7
  Top Layer w0.178: J2.3 23.49,56.9 U1.36 18.82,56.9 v1(15.9,53.98) ; U3.4 11.24,19.24 v1(10.92,18.92)
  Bottom Layer w0.178: v1(15.9,53.98) 11.61,49.69 11.61,19.61 v1(10.92,18.92)
U0TXD: length 60.9
  Top Layer w0.178: U3.5 11.94,18.55 11.29,17.91 v1(10.67,17.91) ; J2.2 23.5,58.17 21.45,58.17 ; v1(16.03,55.03) 16.48,55.03 19.62,58.17 21.45,58.17 ; 21.45,58.17 21.44,58.17 ; v1(16.28,24.29) 17.55,24.29 18.96,25.7 D2.2
  Bottom Layer w0.178: v1(16.28,24.29) 14.17,22.18 11.94,22.18 ; 11.94,22.18 11.94,49.25 16.53,53.84 16.53,54.52 v1(16.03,55.03) ; 11.94,22.18 11.94,19.17 10.68,17.91 v1(10.67,17.91)
UCC1: length 15.4
  Top Layer w0.178: RN1.2 12.3,4.44 10.82,2.96 5.74,2.96 4.34,4.35 UART.A5
UCC2: length 11.6
  Top Layer w0.178: UART.B5 7.34,3.77 7.77,3.34 10.44,3.34 11.5,4.4 RN1.1
UD+: length 24.6
  Top Layer w0.178: U3.7 12.94,18.36 13.1,18.2 13.99,18.2 14.35,17.84 14.35,16.65 10.28,12.57 9.26,12.57 8.51,11.82 v1(8.51,11.05) ; 6.34,4.99 6.34,3.97 ; 6.34,4.99 UART.B6 ; 6.34,4.99 5.49,4.99 5.34,5.13 UART.A6
  Bottom Layer w0.178: v1(6.34,3.97) 6.34,10.08 7.31,11.05 v1(8.51,11.05)
UD-: length 24.7
  Top Layer w0.178: v1(5.36,4.35) 4.84,4.87 UART.B7 ; 4.85,6.3 4.85,6.64 5.1,6.89 5.61,6.89 5.84,6.66 UART.A7 ; U3.8 13.89,19 14.68,18.21 14.68,16.51 10.36,12.19 9.65,12.19 v1(9.14,11.68)
  Bottom Layer w0.178: v1(9.14,11.68) 7.48,11.68 5.36,9.56 v1(5.36,4.35)
$3N22002: length 2.1
  Top Layer w0.381: R6.2 D1.1
$3N24719: length 2
  Top Layer w0.178: D2.1 R18.1
$3N24720: length 2
  Top Layer w0.178: D3.1 R19.1

## Copper pours and planes (outline as drawn; the poured copper is in the pictures)
GND on Bottom Layer: 0,62.74 25.4,62.74 25.4,0 0,0

## Text on the board
Bottom Silkscreen Layer: V1.2 | www.rymcu.com | ESP32-S3 | DevKitC-1 | 6 | 9 | 4 | 5 | 7 | 8 | 3 | 11 | 14 | 15 | 16 | 17 | 18 | 10 | 12 | 13 | 46 | 5V | 3V3 | RST | GND | UART | USB | 1 | 2 | 0 | 19 | TX(43) | RX(44) | 39 | 38 | 37 | 36 | 35 | 47 | 21 | 20 | 42 | 41 | 40 | 45 | 48
Top Silkscreen Layer: 3V3 | RST | 5V | 46 | 14 | 15 | 17 | 18 | 10 | 12 | 13 | 16 | 11 | 4 | G | 5 | 7 | 8 | 3 | 6 | 9 | 42 | 40 | 45 | 48 | 47 | TX | RX | 38 | 37 | 35 | 20 | 39 | 36 | 41 | 21 | 19 | 2 | 0 | 1 | @IO38
